# Altium project IndAlarmIf1.PrjPCB
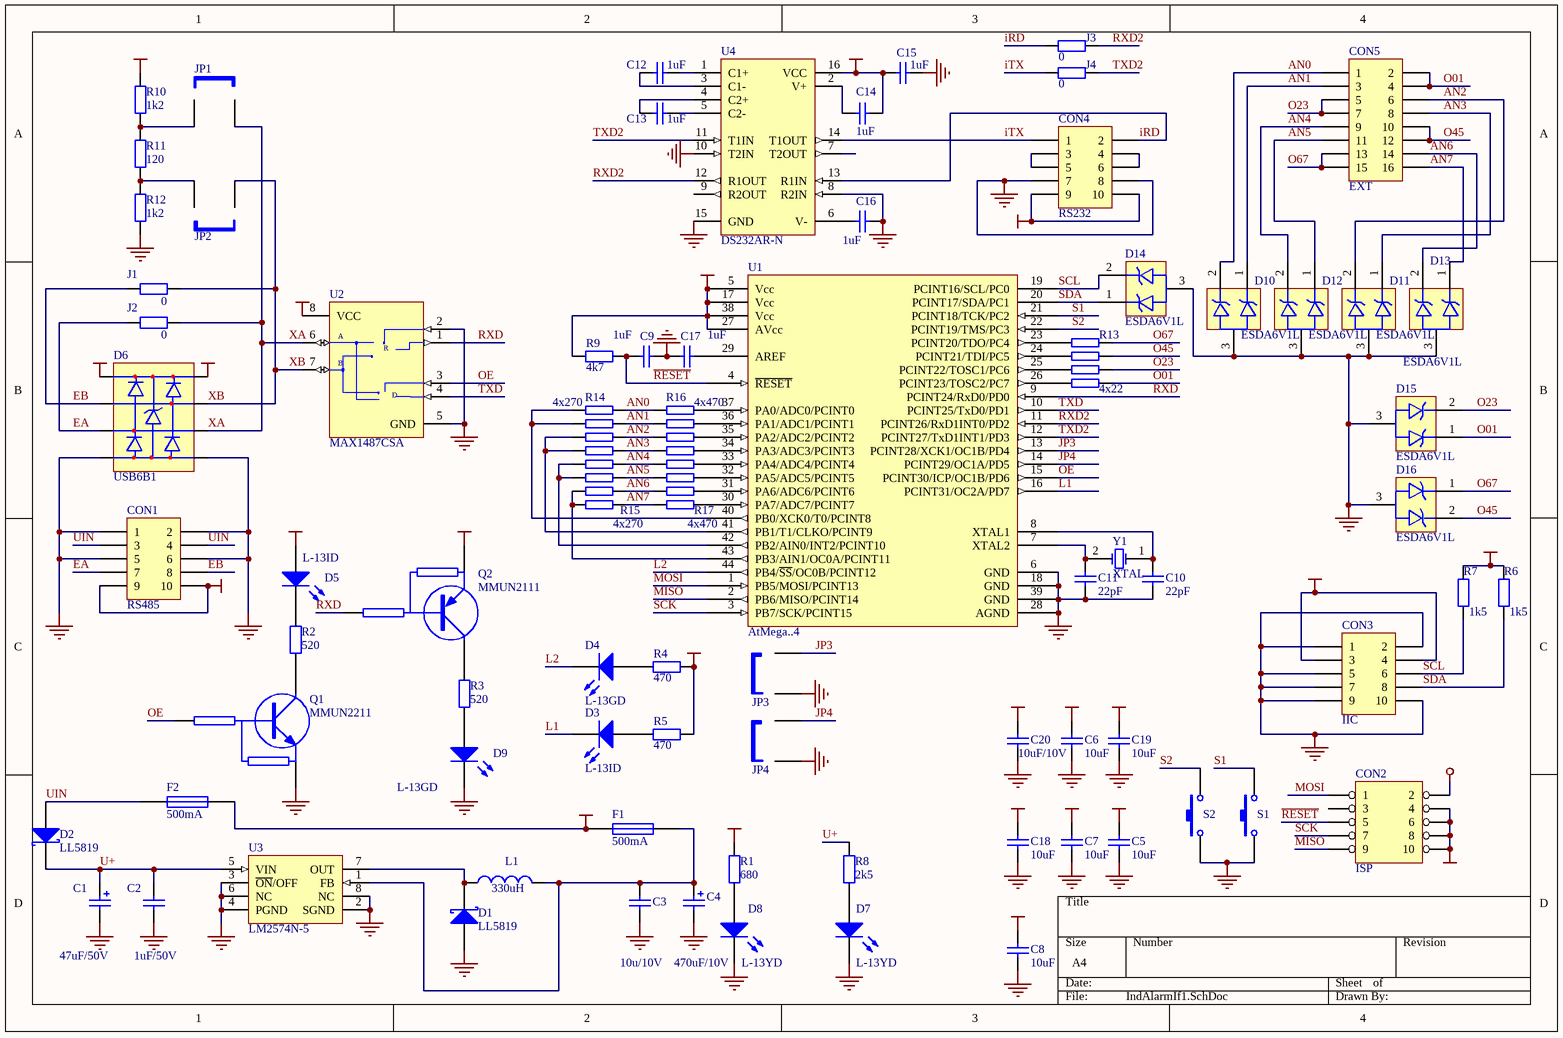
[diagram p0: IndAlarmIf1.SchDoc]
1 sheet, 78 parts. Net scope: global (net labels, ports and power ports of the same name join across sheets).
Board file: IndAlarmIf1.PcbDoc

## Sheet IndAlarmIf1.SchDoc
size A4

### Parts
C1  value 47uF/50V  [C6X11RM2.5]  (hidden comment: Cap Pol1)
C2  value 1uF/50V  [CC3225-1210]  (hidden comment: Cap Semi)
C3  value 10u/10V  [CC3225-1210]  (hidden comment: Cap Semi)
C4  value 470uF/10V  [C8X11RM3.5]  (hidden comment: Cap Pol1)
C5  value 10uF  [CC3216-1206]  (hidden comment: Cap Semi)
C6  value 10uF  [CC3216-1206]  (hidden comment: Cap Semi)
C7  value 10uF  [CC3216-1206]  (hidden comment: Cap Semi)
C8  value 10uF  [CC3225-1210]  (hidden comment: Cap Semi)
C9  value 1uF  [CC2012-0805]  (hidden comment: Cap Semi)
C10  value 22pF  [CC2012-0805]  (hidden comment: Cap Semi)
C11  value 22pF  [CC2012-0805]  (hidden comment: Cap Semi)
C12  value 1uF  [CC2012-0805]  (hidden comment: Cap Semi)
C13  value 1uF  [CC2012-0805]  (hidden comment: Cap Semi)
C14  value 1uF  [CC2012-0805]  (hidden comment: Cap Semi)
C15  value 1uF  [CC3216-1206]  (hidden comment: Cap Semi)
C16  value 1uF  [CC2012-0805]  (hidden comment: Cap Semi)
C17  value 1uF  [CC2012-0805]  (hidden comment: Cap Semi)
C18  value 10uF  [CC3216-1206]  (hidden comment: Cap Semi)
C19  value 10uF  [CC3216-1206]  (hidden comment: Cap Semi)
C20  value 10uF/10V  [CC3216-1206]  (hidden comment: Cap Semi)
CON1  RS485  [HDR2X5]
CON2  ISP  [HDR2X5]
CON3  IIC  [HDR2X5]
CON4  RS232  [HDR2X5]
CON5  EXT  [HDR2X8]
D1  LL5819  [MELF]
D2  LL5819  [MELF]
D3  L-13ID  [LED3mm]
D4  L-13GD  [LED3mm]
D5  L-13ID  [LED3mm]
D6  USB6B1  [NSO8]
D7  L-13YD  [LED3mm]
D8  L-13YD  [LED3mm]
D9  L-13GD  [LED3mm]
D10  ESDA6V1L  [SO-G3/C2.5]
D11  ESDA6V1L  [SO-G3/C2.5]
D12  ESDA6V1L  [SO-G3/C2.5]
D13  ESDA6V1L  [SO-G3/C2.5]
D14  ESDA6V1L  [SO-G3/C2.5]
D15  ESDA6V1L  [SO-G3/C2.5]
D16  ESDA6V1L  [SO-G3/C2.5]
F1  500mA  [minifuse]
F2  500mA  [minifuse]
J1  value 0  [CR2012-0805]
J2  value 0  [CR2012-0805]
J3  value 0  [CR2012-0805]  (hidden comment: Res Semi)
J4  value 0  [CR2012-0805]  (hidden comment: Res Semi)
JP1  Jumper  [JP]  (value not drawn)
JP2  Jumper  [JP]  (value not drawn)
JP3  Jumper  [JP]  (value not drawn)
JP4  Jumper  [JP]  (value not drawn)
L1  value 330uH  [NPIS27H]  (hidden comment: Inductor)
Q1  MMUN2211  [SO-G3/C2.5]
Q2  MMUN2111  [SO-G3/C2.5]
R1  value 680  [CR2012-0805]  (hidden comment: Res Semi)
R2  value 520  [CR2012-0805]  (hidden comment: Res Semi)
R3  value 520  [CR2012-0805]  (hidden comment: Res Semi)
R4  value 470  [CR2012-0805]  (hidden comment: Res Semi)
R5  value 470  [CR2012-0805]  (hidden comment: Res Semi)
R6  value 1k5  [CR2012-0805]  (hidden comment: Res Semi)
R7  value 1k5  [CR2012-0805]  (hidden comment: Res Semi)
R8  value 2k5  [CR5025-2010]  (hidden comment: Res Semi)
R9  value 4k7  [CR2012-0805]  (hidden comment: Res Semi)
R10  value 1k2  [CR2012-0805]  (hidden comment: Res Semi)
R11  value 120  [CR5025-2010]  (hidden comment: Res Semi)
R12  value 1k2  [CR2012-0805]  (hidden comment: Res Semi)
R13  4x22  [YC164]
R14  4x270  [YC164]
R15  4x270  [YC164]
R16  4x470  [YC164]
R17  4x470  [YC164]
S1  SW-PB  [SPPB512300+minicw]  (value not drawn)
S2  SW-PB  [SPPB6A0400-R]  (value not drawn)
U1  AtMega..4
U2  MAX1487CSA  [NSO8]
U3  LM2574N-5  [626-05]
U4  DS232AR-N  [SOIC16N]
Y1  XTAL  [HC49]

### Nets
GND: C1.2 C2.1 C3.1 C4.2 C5.1 C6.1 C7.1 C8.1 C9.1 C10.2 C11.2 C15.1 C16.1 C17.2 C18.1 C19.1 C20.1 CON1.1 CON1.2 CON1.5 CON1.6 CON2.4 CON2.6 CON2.8 CON2.10 CON3.1 CON3.2 CON3.5 CON3.7 CON3.9 CON3.10 CON4.7 CON4.8 D1.1(A) D6.4(GND) D6.5(GND) D7.2(K) D8.2(K) D9.2(K) D10.3 D11.3 D12.3 D13.3 D14.3 D15.3 D16.3 JP3.1 JP4.1 Q1.2(E) R12.1 S1.2 S2.1 S2.3(GND) U1.6(GND) U1.18(GND) U1.28(AGND) U1.39(GND) U2.2(~{RE}) U2.5(GND) U3.2(SGND) U3.3(~{ON}/OFF) U3.4(PGND) U3.6(NC) U3.8(NC) U4.8(R2IN) U4.10(T2IN) U4.15(GND)
VCC: C5.2 C6.2 C7.2 C8.2 C14.1 C15.2 C18.2 C19.2 C20.2 CON1.9 CON1.10 CON2.2 CON3.3 CON3.4 CON4.9 CON4.10 D5.1(A) D6.1(VCC) D6.8(VCC) F1.1 F2.2 Q2.2(E) R1.2 R4.2 R5.2 R6.2 R7.2 R9.1 R10.1 U1.5(Vcc) U1.17(Vcc) U1.27(AVcc) U1.38(Vcc) U2.8(VCC) U4.16(VCC)
AN0: CON5.1 D10.2 R14.1 R16.8
AN1: CON5.3 D10.1 R14.2 R16.7
AN2: CON5.6 D11.2 R14.3 R16.6
AN3: CON5.8 D11.1 R14.4 R16.5
AN4: CON5.9 D12.2 R15.1 R17.8
AN5: CON5.11 D12.1 R15.2 R17.7
AN6: CON5.14 D13.2 R15.3 R17.6
AN7: CON5.16 D13.1 R15.4 R17.5
EA: CON1.7 D6.6(I/O2) J2.1
EB: CON1.8 D6.7(I/O1) J1.1
iRD: CON4.2 J3.1 U4.13(R1IN)
iTX: CON4.1 J4.1 U4.14(T1OUT)
JP3: JP3.2 U1.13(PCINT28/XCK1/OC1B/PD4)
JP4: JP4.2 U1.14(PCINT29/OC1A/PD5)
L1: D3.2(K) U1.16(PCINT31/OC2A/PD7)
L2: D4.2(K) U1.44(PB4/~{SS}/OC0B/PCINT12)
MISO: CON2.9 U1.2(PB6/MISO/PCINT14)
MOSI: CON2.1 U1.1(PB5/MOSI/PCINT13)
O01: CON5.2 CON5.4 D15.1 R13.4
O23: CON5.5 CON5.7 D15.2 R13.3
O45: CON5.10 CON5.12 D16.2 R13.2
O67: CON5.13 CON5.15 D16.1 R13.1
OE: Q1.1(B) U1.15(PCINT30/ICP/OC1B/PD6) U2.3(DE)
~{RESET}: C9.2 CON2.5 R9.2 U1.4(~{RESET})
RXD: Q2.1(B) U1.9(PCINT24/RxD0/PD0) U2.1(RO)
RXD2: J3.2 U1.11(PCINT26/RxD1INT0/PD2) U4.12(R1OUT)
S1: S1.1 U1.21(PCINT18/TCK/PC2)
S2: S2.2 U1.22(PCINT19/TMS/PC3)
SCK: CON2.7 U1.3(PB7/SCK/PCINT15)
SCL: CON3.6 D14.2 R7.1 U1.19(PCINT16/SCL/PC0)
SDA: CON3.8 D14.1 R6.1 U1.20(PCINT17/SDA/PC1)
TXD: U1.10(PCINT25/TxD0/PD1) U2.4(DI)
TXD2: J4.2 U1.12(PCINT27/TxD1INT1/PD3) U4.11(T1IN)
U+: C1.1 C2.2 D2.2(K) R8.2 U3.5(VIN)
UIN: CON1.3 CON1.4 D2.1(A) F2.1
XA: D6.3(I/O2) J2.2 JP1.2 U2.6(A)
XB: D6.2(I/O1) J1.2 JP2.1 U2.7(B)
NetC3_2: C3.2 C4.1 F1.2 L1.2 U3.1(FB)
NetC10_1: C10.1 U1.8(XTAL1) Y1.1(OSC1)
NetC11_1: C11.1 U1.7(XTAL2) Y1.2(OSC2)
NetC12_1: C12.1 U4.1(C1+)
NetC12_2: C12.2 U4.3(C1-)
NetC13_1: C13.1 U4.5(C2-)
NetC13_2: C13.2 U4.4(C2+)
NetC14_2: C14.2 U4.2(V+)
NetC16_2: C16.2 U4.6(V-)
NetC17_1: C17.1 U1.29(AREF)
NetCON4_3: CON4.3 CON4.5
NetCON4_4: CON4.4 CON4.6
NetD1_2: D1.2(K) L1.1 U3.7(OUT)
NetD3_1: D3.1(A) R5.1
NetD4_1: D4.1(A) R4.1
NetD5_2: D5.2(K) R2.2
NetD7_1: D7.1(A) R8.1
NetD8_1: D8.1(A) R1.1
NetD9_1: D9.1(A) R3.1
NetJP1_1: JP1.1 R10.2 R11.2
NetJP2_2: JP2.2 R11.1 R12.2
NetQ1_3: Q1.3(C) R2.1
NetQ2_3: Q2.3(C) R3.2
NetR13_5: R13.5 U1.26(PCINT23/TOSC2/PC7)
NetR13_6: R13.6 U1.25(PCINT22/TOSC1/PC6)
NetR13_7: R13.7 U1.24(PCINT21/TDI/PC5)
NetR13_8: R13.8 U1.23(PCINT20/TDO/PC4)
NetR14_5: R14.5 R14.6 U1.41(PB1/T1/CLKO/PCINT9)
NetR14_7: R14.7 R14.8 U1.40(PB0/XCK0/T0/PCINT8)
NetR15_5: R15.5 R15.6 U1.43(PB3/AIN1/OC0A/PCINT11)
NetR15_7: R15.7 R15.8 U1.42(PB2/AIN0/INT2/PCINT10)
NetR16_1: R16.1 U1.37(PA0/ADC0/PCINT0)
NetR16_2: R16.2 U1.36(PA1/ADC1/PCINT1)
NetR16_3: R16.3 U1.35(PA2/ADC2/PCINT2)
NetR16_4: R16.4 U1.34(PA3/ADC3/PCINT3)
NetR17_1: R17.1 U1.33(PA4/ADC4/PCINT4)
NetR17_2: R17.2 U1.32(PA5/ADC5/PCINT5)
NetR17_3: R17.3 U1.31(PA6/ADC6/PCINT6)
NetR17_4: R17.4 U1.30(PA7/ADC7/PCINT7)

Not connected (* = marked no-connect by the designer): CON2 3; U4 7(T2OUT) 9(R2OUT)

### Notes on the sheet
- (in symbol MAX1487CSA) R; D

### Library data of the parts
C1 C4 = Cap Pol1: Polarized Capacitor (Radial); Published: 8-Jun-2000; Revision: July-2002: Re-released for DXP Platform.; Publisher: Altium Limited
C2 C3 C5-C20 = Cap Semi: Capacitor (Semiconductor SIM Model); Published: 8-Jun-2000; Revision: July-2002: Re-released for DXP Platform.; Publisher: Altium Limited
CON1 CON3 CON4 = Header 5X2: Header, 5-Pin, Dual row; Revision: 17-Jul-2002: Re-released for DXP Platform.; Publisher: Altium Limited
CON2 = HEADER 5X2
CON5 = Header 8X2: Header, 8-Pin, Dual row; Revision: 17-Jul-2002: Re-released for DXP Platform.; Publisher: Altium Limited
D1 D2 = D Schottky: Schottky Diode; Code - JEDEC: DO-214-AA; Published: 8-Jun-2000; Revision: July-2002: Re-released for DXP Platform.; Publisher: Altium Limited
D3-D5 D7-D9 = LED3: Typical BLUE SiC LED; Revision 1: Jul-2002: Re-released for DXP Platform.; Revision 2: 17-Dec-2003: PCB Footprint replaced.; Published: 8-Jun-2000; Publisher: Altium Limited
D10-D16 = ESDA6V1L: DUAL TRANSIL ARRAY / FOR ESD PROTECTION
F1 F2 = Fuse 1: Fuse; Published: 8-Jun-2000; Revision: July-2002: Re-released for DXP Platform.; Publisher: Altium Limited
J1-J4 R1-R12 = Res Semi: Semiconductor Resistor; Published: 8-Jun-2000; Revision: July-2002: Re-released for DXP Platform.; Publisher: Altium Limited
JP1-JP4 = Jumper: Jumper Wire; Published: 24-Mar-1999; Revision: July-2002: Re-released for DXP Platform.; Publisher: Altium Limited
Q1 = NPNR1: NPN Transistor
Q2 = PNPR1: NPN Transistor
R13-R17 = RES4
S1 S2 = SW-PB: Switch; Published: 24-Mar-1999; Revision: July-2002: Re-released for DXP Platform.; Publisher: Altium Limited
U1 = ATMEGA164PA-AU
U2 = MAX1487CSA: Low-Power, Slew-Rate-Limited RS-485/RS-422 Transceiver; Code - JEDEC: MS-012-AA; Code - IPC: SO8; Published: 16-Jan-2001; Revision: 17-Jul-2002: Re-released for DXP Platform.; Datasheet: Latest Revision: Feb-1996; Package Reference: NSO8; Publisher: Altium Limited
U3 = LM2574N-5: Easy Switcher 0.5A Step-Down Voltage Regulator; Package Information: Latest Revision: 1998; Published: 15-Apr-2002; Datasheet: Latest Revision: Jul-1999; Package Reference: 626-05; Publisher: Altium Limited
U4 = DS232AR-N: Dual RS-232 Transmitter/Receiver; Package Information: Latest Revision: 1999; Published: 13-Oct-2000; Revision: 17-Jul-2002: Re-released for DXP Platform.; Datasheet: Latest Revision: 19-Feb-1998; Package Reference: SOIC16N; Publisher: Altium Limited
Y1 = XTAL: Crystal Oscillator; Published: 8-Jun-2000; Revision: July-2002: Re-released for DXP Platform.; Publisher: Altium Limited
L1 = Inductor: Published: 8-Jun-2000; Revision: July-2002: Re-released for DXP Platform.; Publisher: Altium Limited